# EasyEDA Pro project pcb.epro, schematic Schematic1
Assembly Variant: Basic; Board Name: Board1; Create Date: 2026-03-14; Page Name: P1; Project Name: stm32; Schematic Name: Schematic1; Update Date: 2026-03-14; Company: 嘉立创EDA; Page Size: A4; Version: V1.0
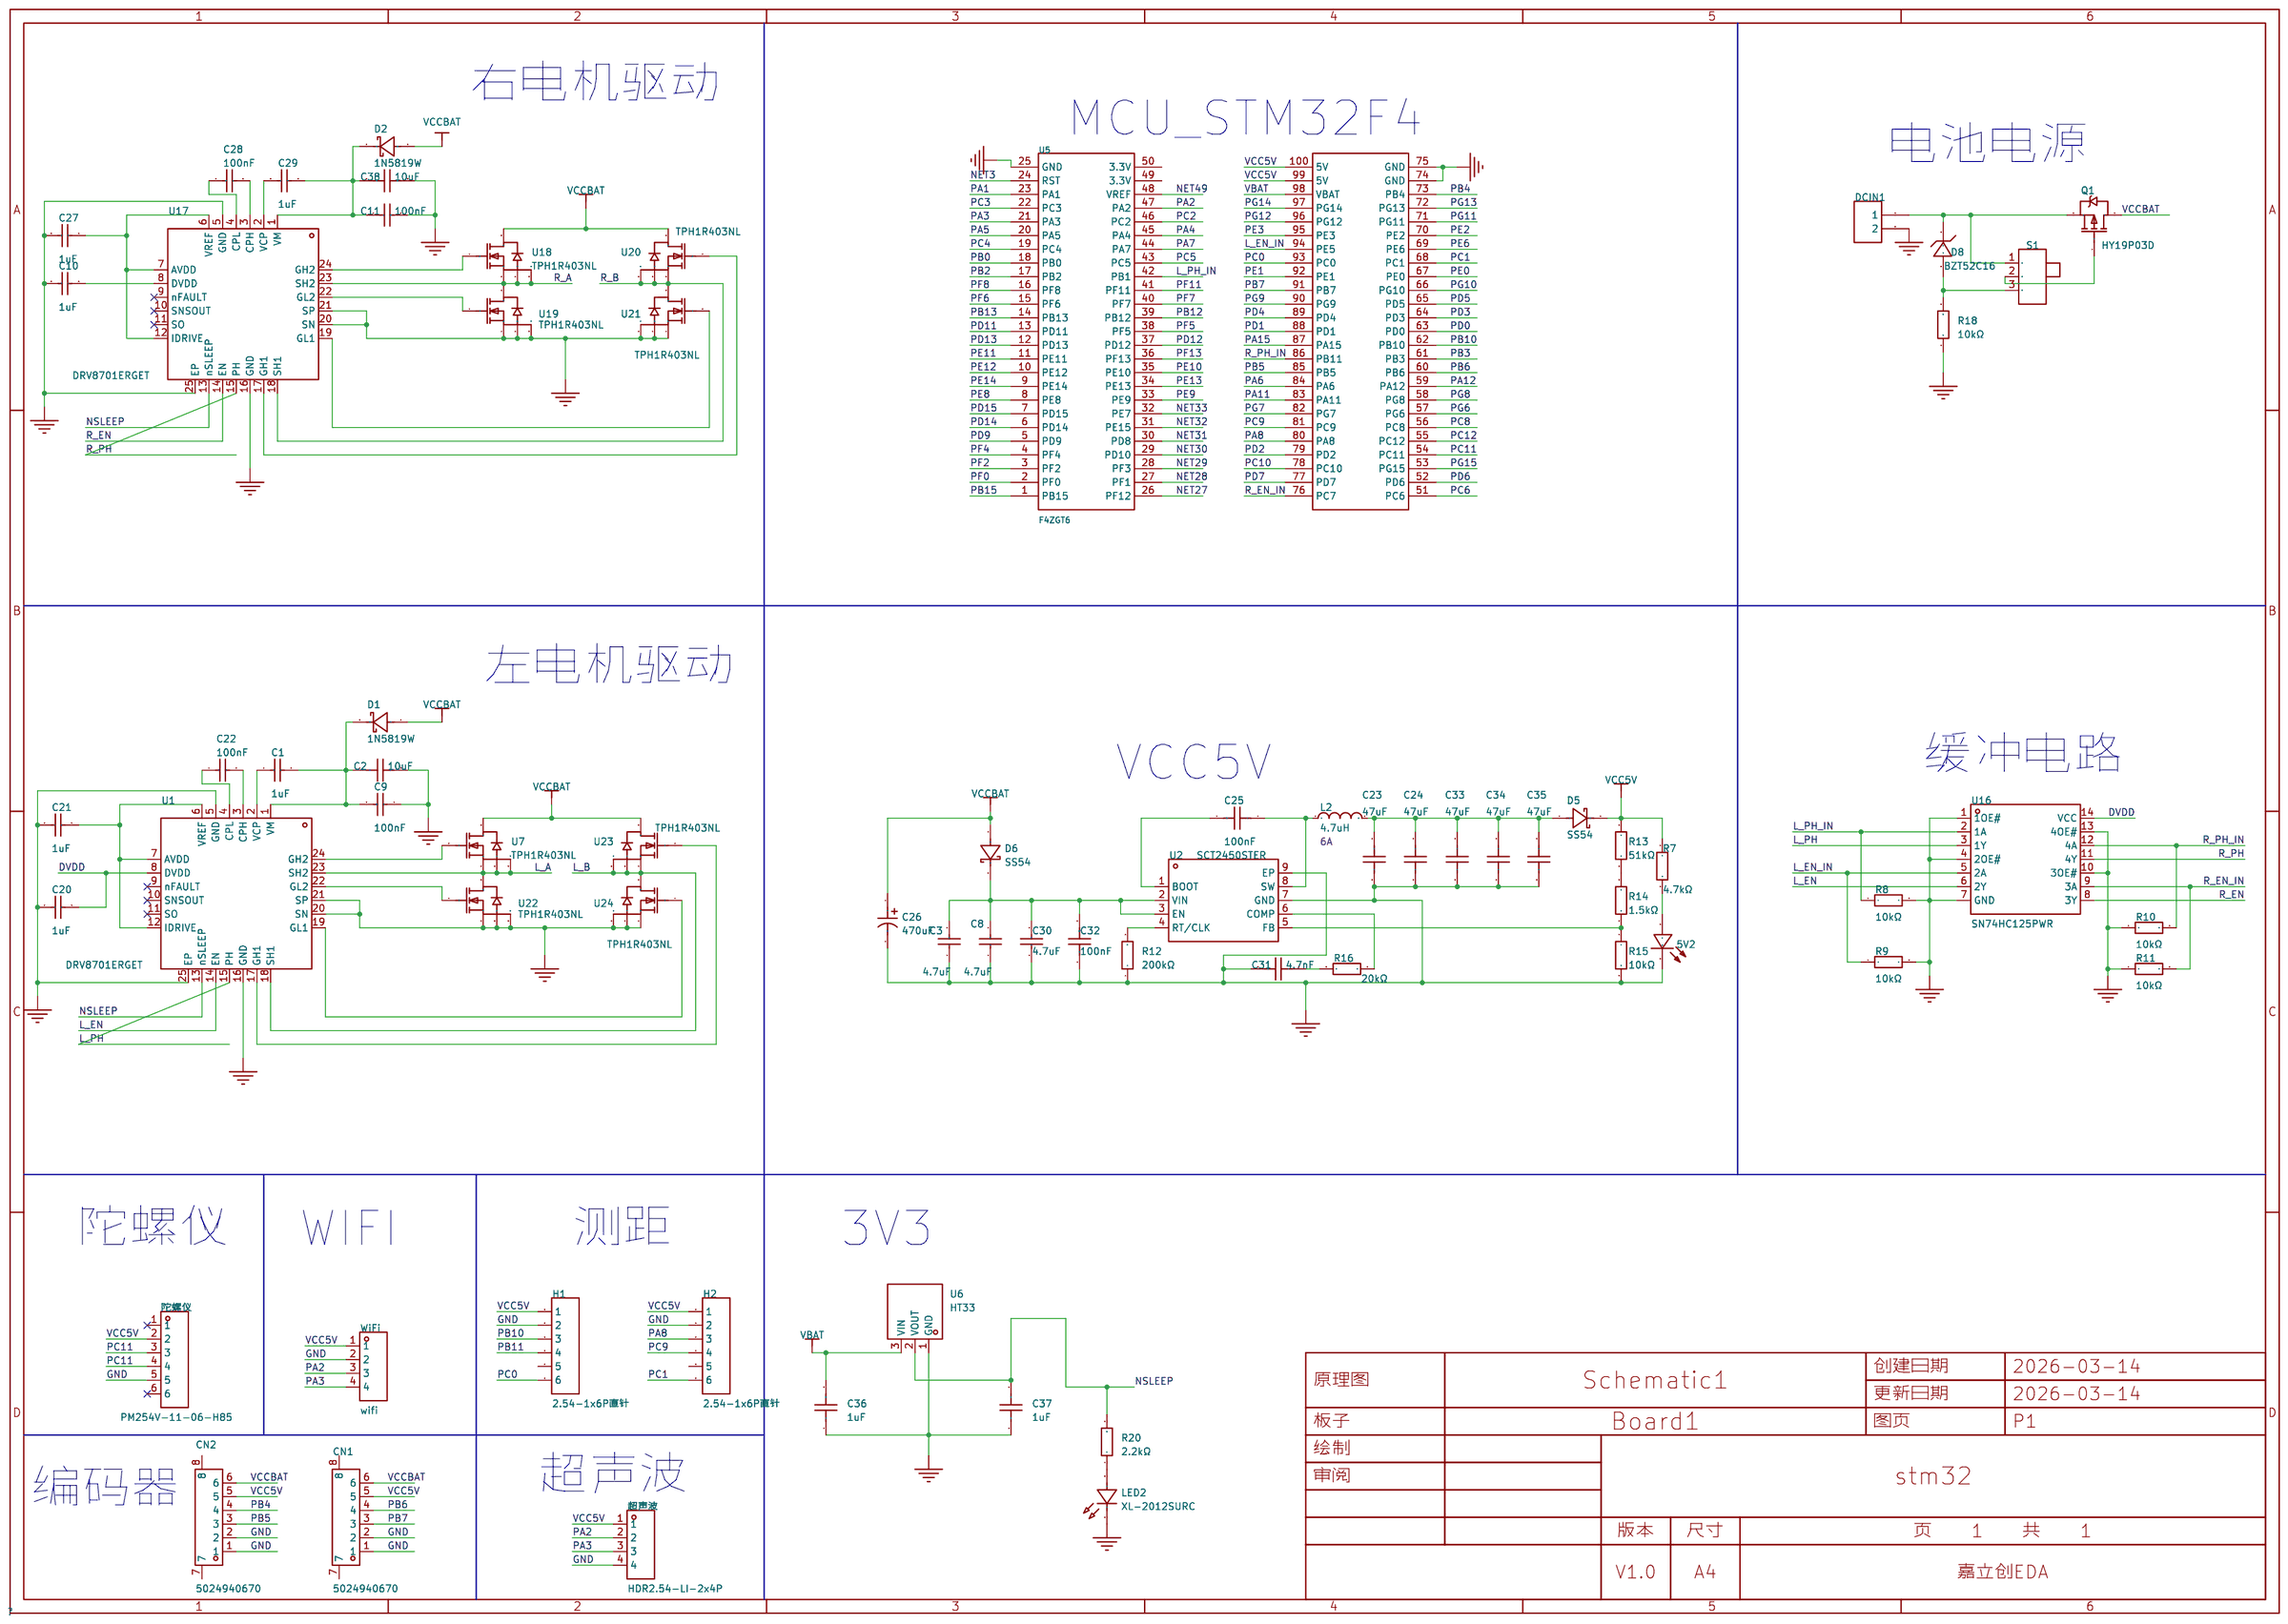
[diagram p0: schematic sheet]

## Parts
5V2  15-21VGC/TR8  [LED0603_GREEN]
C1  1uF  [C0603]
C2  10uF  [C0603]
C3  4.7uF  [C0805]
C8  4.7uF  [C0805]
C9  100nF  [C0603]
C10  1uF  [C0603]
C11  100nF  [C0603]
C20  1uF  [C0603]
C21  1uF  [C0603]
C22  100nF  [C0603]
C23  47uF  [C1210]
C24  47uF  [C1210]
C25  100nF  [C0603]
C26  470uF  [CAP-TH_BD8.0-P3.50-D0.6-FD_1]
C27  1uF  [C0603]
C28  100nF  [C0603]
C29  1uF  [C0603]
C30  4.7uF  [C0603]
C31  4.7nF  [C0603]
C32  100nF  [C0603]
C33  47uF  [C1210]
C34  47uF  [C1210]
C35  47uF  [C1210]
C36  1uF  [C0603]
C37  1uF  [C0603]
C38  10uF  [C0603]
CN1  5024940670  [CONN-SMD_5024940670]
CN2  5024940670  [CONN-SMD_5024940670]
D1  1N5819W  [SOD-123_L2.7-W1.6-LS3.7-R-RD]
D2  1N5819W  [SOD-123_L2.7-W1.6-LS3.7-R-RD]
D5  SS54  [SMA_L4.4-W2.8-LS5.4-R-RD]
D6  SS54  [SMA_L4.4-W2.8-LS5.4-R-RD]
D8  BZT52C16  [SOD-123_L2.7-W1.6-LS3.7-RD]
DCIN1  -  [con_5mm]
H1  2.54-1x6P直针  [HDR-TH_6P-P2.54-V-M-1]
H2  2.54-1x6P直针  [HDR-TH_6P-P2.54-V-M-1]
L2  4.7uH  [IND-SMD_L7.2-W6.6_GPSR07X0]
LED2  XL-2012SURC  [LED0805-RD_RED]
Q1  HY19P03D  [TO-252-2_L6.6-W6.1-P4.57-LS9.9-TL-CW]
R7  4.7kΩ  [R0603]
R8  10kΩ  [R0603]
R9  10kΩ  [R0603]
R10  10kΩ  [R0603]
R11  10kΩ  [R0603]
R12  200kΩ  [R0603]
R13  51kΩ  [R0603]
R14  1.5kΩ  [R0603]
R15  10kΩ  [R0603]
R16  20kΩ  [R0603]
R18  10kΩ  [R0603]
R20  2.2kΩ  [R0603]
S1  K3-1391D-5MM  [SW-TH_K3-1391D-5MM]
U1  DRV8701ERGET  [VQFN-24_L4.0-W4.0-P0.50-BL-EP2.5]
U2  SCT2450STER  [ESOP-8_L4.9-W3.9-P1.27-LS6.0-BL-EP]
U5  F4ZGT6  [STM32F407ZGT6—正点原子最小系统板【旧版】]
U6  HT33  [SOT-23-3_L2.9-W1.3-P1.90-LS2.4-BL-1]
U7  TPH1R403NL  [TDSON-8_L5.9-W5.2-P1.27-BL]
U16  SN74HC125PWR  [TSSOP-14_L5.0-W4.4-P0.65-LS6.5-BL]
U17  DRV8701ERGET  [VQFN-24_L4.0-W4.0-P0.50-BL-EP2.5]
U18  TPH1R403NL  [TDSON-8_L5.9-W5.2-P1.27-BL]
U19  TPH1R403NL  [TDSON-8_L5.9-W5.2-P1.27-BL]
U20  TPH1R403NL  [TDSON-8_L5.9-W5.2-P1.27-BL]
U21  TPH1R403NL  [TDSON-8_L5.9-W5.2-P1.27-BL]
U22  TPH1R403NL  [TDSON-8_L5.9-W5.2-P1.27-BL]
U23  TPH1R403NL  [TDSON-8_L5.9-W5.2-P1.27-BL]
U24  TPH1R403NL  [TDSON-8_L5.9-W5.2-P1.27-BL]
WiFi  wifi  [HDR-TH_4P-P2.54-V-F]
超声波  HDR2.54-LI-2x4P  [HDR-TH_4P-P2.54-V-M]
陀螺仪  PM254V-11-06-H85  [HDR-TH_6P-P2.54-V-F]

## Library data of the parts
5V2 = 15-21VGC/TR8: 照明颜色:普绿/黄绿;色温 - CCT（K）:-;主波长/色坐标:571nm;; LCSC Part Name: 发光二极管1206普绿/黄绿; Supplier Part: C131289; Manufacturer: EVERLIGHT(亿光); Supplier Footprint: 1206; JLCPCB Part Class: Extended Part; Datasheet: https://atta.szlcsc.com/upload/public/pdf/source/20170918/C131289_1505726897595976297.pdf; Supplier: LCSC; Mounting Type: 表面贴装; Illumination Color: 普绿/黄绿; Luminous Intensity (IF=20mA): 13mcd; Dominant Wavelength / Coordinate rank: 571nm
C1 C10 C20 C21 C27 C29 = CL10A105KB8NNNC: 容值:1uF;精度:±10%;额定电压:50V;材质(温度系数):X5R;; LCSC Part Name: 1uF ±10% 50V; Supplier Part: C15849; Manufacturer: SAMSUNG(三星); Supplier Footprint: 0603; JLCPCB Part Class: 基础库; Datasheet: https://atta.szlcsc.com/upload/public/pdf/source/20160218/1457707763339.pdf; Supplier: LCSC; Tolerance: ±10%; Voltage Rated: 50V; Temperature Coefficient: X5R
C2 C38 = CL10A106MA8NRNC: 容值:10uF;精度:±20%;额定电压:25V;材质(温度系数):X5R;; LCSC Part Name: 10uF ±20% 25V; Supplier Part: C96446; Manufacturer: SAMSUNG(三星); Supplier Footprint: 0603; JLCPCB Part Class: 基础库; Datasheet: https://atta.szlcsc.com/upload/public/pdf/source/20160218/1457707763339.pdf; Supplier: LCSC; Tolerance: ±20%; Voltage Rated: 25V; Temperature Coefficient: X5R
C3 C8 = CL21A475KAQNNNE: 容值:4.7uF;精度:±10%;额定电压:25V;温度系数:X5R;; LCSC Part Name: 4.7uF ±10% 25V; Supplier Part: C1779; Manufacturer: SAMSUNG(三星); Supplier Footprint: 0805; JLCPCB Part Class: 基础库; Datasheet: https://item.szlcsc.com/datasheet/CL21A475KAQNNNE/2131.html; Supplier: LCSC; Tolerance: ±10%; Voltage Rating: 25V; Temperature Coefficient: X5R
C9 C11 C22 C28 = 0603B104K500NT: 容值:100nF;精度:±10%;额定电压:50V;材质(温度系数):X7R;; LCSC Part Name: 100nF ±10% 50V; Supplier Part: C30926; Manufacturer: FH(风华); Supplier Footprint: 0603; JLCPCB Part Class: 扩展库; Datasheet: https://atta.szlcsc.com/upload/public/pdf/source/20200305/C486355_26A10D38EF8C2A5C37091D0039909270.pdf; Supplier: LCSC; Tolerance: ±10%; Voltage Rated: 50V; Temperature Coefficient: X7R
C23 C24 C33-C35 = GRM32ER61C476KE15L: 容值:47uF;精度:±10%;额定电压:16V;温度系数:X5R;; LCSC Part Name: 47uF ±10% 16V; Supplier Part: C77101; Manufacturer: muRata(村田); Supplier Footprint: 1210; JLCPCB Part Class: 扩展库; Datasheet: https://item.szlcsc.com/datasheet/GRM32ER61C476KE15L/78228.html; Supplier: LCSC; Tolerance: ±10%; Voltage Rating: 16V; Temperature Coefficient: X5R
C25 C32 = CL10B104KB8NNNC: 容值:100nF;精度:±10%;额定电压:50V;材质(温度系数):X7R;; LCSC Part Name: 100nF ±10% 50V; Supplier Part: C1591; Manufacturer: SAMSUNG(三星); Supplier Footprint: 0603; JLCPCB Part Class: Extended Part; Datasheet: https://atta.szlcsc.com/upload/public/pdf/source/20160103/1457707680512.pdf; Supplier: LCSC; Tolerance: ±10%; Voltage Rated: 50V; Temperature Coefficient: X7R
C26 = CD2884771EM0812VFL: 容值:470uF;精度:±20%;额定电压:25V;纹波电流:905mA@100kHz;等效串联电阻(ESR):69mΩ@100kHz;; LCSC Part Name: 470uF ±20% 25V; Supplier Part: C2960233; Manufacturer: HRK(鸿瑞凯电子); Supplier Footprint: 插件,D8xL12mm; JLCPCB Part Class: Extended Part; Datasheet: https://item.szlcsc.com/datasheet/CD2884771EM0812VFL/3346945.html; Supplier: LCSC; Tolerance: ±20%; Voltage Rating: 25V; Ripple Current: 905mA@100kHz; Equivalent Series Resistance(ESR): 69mΩ@100kHz; Pin Spacing: 3.5mm; Diameter: 8mm; Height - Seated (Max): 12mm; Lifetime: 3000hrs@105℃; Operating Temperature: -40℃~+105℃
C30 = CL31B475KBHNNNE: 容值:4.7uF;精度:±10%;额定电压:50V;材质(温度系数):X7R;; LCSC Part Name: 4.7uF ±10% 50V; Supplier Part: C51205; Manufacturer: SAMSUNG(三星); Supplier Footprint: 1206; JLCPCB Part Class: Extended Part; Datasheet: https://atta.szlcsc.com/upload/public/pdf/source/20160103/1457707732693.pdf; Supplier: LCSC; Tolerance: ±10%; Voltage Rated: 50V; Temperature Coefficient: X7R
C31 = MT18B472K500CT: 容值:4.7nF;精度:±10%;额定电压:50V;材质(温度系数):X7R;; LCSC Part Name: 4.7nF ±10% 50V; Supplier Part: C366882; Manufacturer: Walsin(华新科); Supplier Footprint: 0603; JLCPCB Part Class: 扩展库; Datasheet: https://atta.szlcsc.com/upload/public/pdf/source/20190225/C366882_E806E7D8175088070BA62B5811C10C1A.pdf; Supplier: LCSC; Tolerance: ±10%; Voltage Rated: 50V; Temperature Coefficient: X7R
C36 C37 = CGA0603X5R105K500JT: 容值:1uF;精度:±10%;额定电压:50V;温度系数:X5R;; LCSC Part Name: 1uF ±10% 50V; Supplier Part: C6119852; Manufacturer: HRE(芯声); Supplier Footprint: 0603; JLCPCB Part Class: 扩展库; Supplier: LCSC; Tolerance: ±10%; Voltage Rating: 50V; Temperature Coefficient: X5R
CN1 CN2 = 5024940670: 插针结构:1x6P;间距:2mm;安装方式:卧贴;总PIN数:6P;排数:1;每排PIN数:6;额定电流:3A;触头镀层:锡;工作温度:-40℃~+105℃;; LCSC Part Name: 1x6P 间距:2mm 卧贴; Supplier Part: C587930; Manufacturer: MOLEX; Supplier Footprint: SMD,P=2mm,卧贴; JLCPCB Part Class: Extended Part; Datasheet: https://www.molex.com/content/dam/molex/molex-dot-com/products/automated/en-us/salesdrawingpdf/502/502494/5024940670_sd.pdf?inline\; Supplier: LCSC; Pins Structure: 1x6P; Pitch: 2mm; Mounting Type: 卧贴; Number of Pins: 6P; Number of Rows: 1; Number of PINs Per Row: 6; Current Rating: 3A; Contact Plating: 锡; Operating Temperature: -40℃~+105℃; Voltage Rating: 250V
D1 D2 = 1N5819W_C963381: 二极管配置:独立式;正向压降(Vf):600mV@200mA;直流反向耐压(Vr):40V;平均整流电流(Io):350mA;; LCSC Part Name: 电压:40V 电流:350mA; Supplier Part: C963381; Manufacturer: JSMSEMI(杰盛微); Supplier Footprint: SOD-123; JLCPCB Part Class: 扩展库; Datasheet: https://atta.szlcsc.com/upload/public/pdf/source/20230807/ADD53622154D5B572F84A7B877E922CE.pdf; Supplier: LCSC; Diode Configuration: 独立式; Forward Voltage (Vf@If): 600mV@200mA; Reverse Voltage (Vr): 40V; Average Rectified Current (Io): 350mA; Reverse Leakage Current (Ir): 5uA@30V
D5 D6 = SS54_C513478: 直流反向耐压(Vr):40V;平均整流电流(Io):5A;正向压降(Vf):550mV@5A;; LCSC Part Name: 40V 5A 550mV@5A; Supplier Part: C513478; Manufacturer: Slkor(萨科微); Supplier Footprint: SMA; JLCPCB Part Class: Extended Part; Datasheet: https://atta.szlcsc.com/upload/public/pdf/source/20200414/C513471_6461A1BCB05B602A4F47401B394AA5A8.pdf; Supplier: LCSC; Reverse Voltage (Vr): 40V; Average Rectified Current (Io): 5A; Forward Voltage (Vf@If): 550mV@5A
D8 = BZT52C16_C173426: 二极管配置:独立式;稳压值(标称值):16V;稳压值(范围):15.3V~17.1V;精度:-;功率:500mW;反向电流(Ir):100nA@11.2V;阻抗(Zzt):40Ω;; LCSC Part Name: 16V 500mW; Supplier Part: C173426; Manufacturer: MDD; Supplier Footprint: SOD-123; JLCPCB Part Class: Extended Part; Datasheet: https://atta.szlcsc.com/upload/public/pdf/source/20180207/C173426_15179895458921356272.pdf; Supplier: LCSC; Diode Configuration: 独立式; Zener Voltage (Nom): 16V; Zener Voltage (Range): 15.3V~17.1V; Power Dissipation: 500mW; Reverse Leakage Current (Ir): 100nA@11.2V; Zener Impedance (Zzt): 40Ω
DCIN1 = DCIN
H1 H2 = 2.54-1x6P直针: 插针结构:1x6P;间距:2.54mm;行距:-;圆针/方针:方针;安装方式:直插;排数:单排;总PIN位数:6P;额定电流:3A;额定电压:-;配合针长度:6mm;塑高:2.5mm;端接针长度:3mm;触头材质:黄铜;触头镀层:金;工作温度:-40℃~+105℃;颜色:黑色;; LCSC Part Name: 1x6P 间距:2.54mm 方针 直插; Supplier Part: C37208; Manufacturer: BOOMELE(博穆精密); Supplier Footprint: 插件,P=2.54mm; JLCPCB Part Class: Extended Part; Datasheet: https://item.szlcsc.com/datasheet/2.54-1x6P%25E7%259B%25B4%25E9%2592%2588/38187.html; Supplier: LCSC; Pin Structure: 1x6P; Pitch: 2.54mm; Circluar Pins/Square Pins: 方针; Mounting Type: 直插; Number of Rows: 单排; Number of Pins: 6P; Current Rating: 3A; Length of Mating Pin: 6mm; Insulation Height: 2.5mm; Length of End Connection Pin: 3mm; Contact Material: 黄铜; Contact Plating: 金; Operating Temperature: -40℃~+105℃; Color: 黑色
L2 = CYA0650-4.7UH: 电感值:4.7uH;精度:±20%;额定电流:6A;直流电阻(DCR):26mΩ;; LCSC Part Name: 4.7uH ±20%; Supplier Part: C5189754; Manufacturer: SHOU HAN(首韩); Supplier Footprint: SMD,7.2x6.6mm; JLCPCB Part Class: Extended Part; Datasheet: https://atta.szlcsc.com/upload/public/pdf/source/20221010/D01C39F02A771397E3958491D6AA7650.pdf; Supplier: LCSC; Tolerance: ±20%; Rated Current: 6A; DC Resistance (DCR): 26mΩ
LED2 = XL-2012SURC: 发光颜色:红色;功率:55mW;正向电流:25mA;主波长:617nm~621nm;透镜颜色:无色透明透镜;色温:-;发光角度:120°;载带方式:正贴;工作温度:-30℃~+85℃;; Supplier Part: C965812; Manufacturer: XINGLIGHT(成兴光); Supplier Footprint: 0805; JLCPCB Part Class: 扩展库; Datasheet: https://atta.szlcsc.com/upload/public/pdf/source/20221102/49E1A0A365644091E6270AF1C5E0FE37.pdf; Supplier: LCSC; Emitted Color: 红色; Power Dissipation: 55mW; Forward Current: 25mA; Dominant Wavelength: 617nm~621nm; Peak Wavelength: 623nm; Lens Color: 无色透明透镜; Viewing Angle: 120°; Mounting Sytle: 正贴; Operating Temperature: -30℃~+85℃
Q1 = HY19P03D: 导通电阻(RDS(on)@Vgs,Id):6mΩ 45A,10V;阈值电压(Vgs(th)@Id):3V 250μA;漏源电压(Vdss):30V;功率(Pd):50W;类型:P沟道;连续漏极电流(Id):90A;; Supplier Part: C122492; Manufacturer: HUAYI(华羿微); Supplier Footprint: TO-252-2L; JLCPCB Part Class: Extended Part; Datasheet: https://atta.szlcsc.com/upload/public/pdf/source/20170728/C122492_1501225751911848809.pdf; Supplier: LCSC; Drain Source On Resistance (RDS(on)@Vgs,Id): 6mΩ 45A,10V; Gate Threshold Voltage (Vgs(th)@Id): 3V 250μA; Drain Source Voltage (Vdss): 30V; Power Dissipation (Pd): 50W; Type: P沟道; Continuous Drain Current (Id): 90A
R7 R12-R16 R18 = RC0603FR-074K7L: 阻值:4.7kΩ;精度:±1%;功率:100mW;温度系数:±100ppm/℃;最大工作电压:75V;工作温度范围:-55℃~+155℃;; LCSC Part Name: 4.7kΩ ±1% 100mW; Supplier Part: C99782; Manufacturer: YAGEO(国巨); Supplier Footprint: 0603; JLCPCB Part Class: Extended Part; Datasheet: https://atta.szlcsc.com/upload/public/pdf/source/20171030/C99782_15093665213961068236.pdf; Supplier: LCSC; Tolerance: ±1%; Power(Watts): 100mW; Temperature Coefficient: ±100ppm/℃; Overload Voltage (Max): 75V; Operating Temperature Range: -55℃~+155℃
R8-R11 = 0603WAF1002T5E: 电阻类型:厚膜电阻;阻值:10kΩ;精度:±1%;功率:100mW;最大工作电压:75V;温度系数:±100ppm/℃;; LCSC Part Name: 厚膜电阻 10kΩ ±1% 100mW; Supplier Part: C25804; Manufacturer: UNI-ROYAL(厚声); Supplier Footprint: 0603; JLCPCB Part Class: 基础库; Datasheet: https://atta.szlcsc.com/upload/public/pdf/source/20200306/C422600_1E6D84923E4A46A82E41ADD87F860B5C.pdf; Supplier: LCSC; Type: 厚膜电阻; Tolerance: ±1%; Power(Watts): 100mW; Overload Voltage (Max): 75V; Temperature Coefficient: ±100ppm/℃; Operating Temperature Range: -55℃~+155℃
R20 = 0603WAF2201T5E: 电阻类型:厚膜电阻;阻值:2.2kΩ;精度:±1%;功率:100mW;最大工作电压:75V;温度系数:±100ppm/℃;; LCSC Part Name: 2.2kΩ ±1% 100mW 厚膜电阻; Supplier Part: C4190; Manufacturer: UNI-ROYAL(厚声); Supplier Footprint: 0603; JLCPCB Part Class: 基础库; Datasheet: https://atta.szlcsc.com/upload/public/pdf/source/20200306/C422600_1E6D84923E4A46A82E41ADD87F860B5C.pdf; Supplier: LCSC; Type: 厚膜电阻; Tolerance: ±1%; Power(Watts): 100mW; Overload Voltage (Max): 75V; Temperature Coefficient: ±100ppm/℃; Operating Temperature Range: -55℃~+155℃
S1 = K3-1391D-5MM: 额定电流(AC):5A;额定电压(AC):120V;电路结构:单刀双掷;安装方式:直插;机械寿命:30000;开关颜色:黑色;滑钮形状:矩形柱状;引脚样式:PC引脚;工作温度:-25℃~+80℃;开关长度:13.3mm;开关宽度:6mm;开关高度:6.6mm;; LCSC Part Name: 大电流直插式滑动开关; Supplier Part: C970579; Manufacturer: 韩国韩荣; Supplier Footprint: 插件; JLCPCB Part Class: Extended Part; Datasheet: https://atta.szlcsc.com/upload/public/pdf/source/20201211/C970579_603CDB6D9DEEEE4ED10454FCD9A65E24.pdf; Supplier: LCSC; Current Rating (AC): 5A; Voltage Rating (AC): 120V; Circuit: 单刀双掷; Mounting Sytle: 直插; Mechanical Life: 30000; Actuator Color: 黑色; Actuator Style: 矩形柱状; Pin Style: PC引脚; Operating Temperature: -25℃~+80℃; Switch Length: 13.3mm; Switch Width: 6mm; Switch Height: 6.6mm
U1 U17 = DRV8701ERGET: 驱动电机类型:有刷直流电机;电源电压:0V~5.5V;输出电流:-;接口:并行;; LCSC Part Name: 有刷直流电机驱动芯片 5.5V; Supplier Part: C132049; Manufacturer: TI(德州仪器); Supplier Footprint: VQFN-24(4x4); JLCPCB Part Class: 扩展库; Datasheet: https://www.ti.com/cn/lit/gpn/drv8701; Supplier: LCSC; Drive motor type: 有刷直流电机; Supply Voltage: 0V~5.5V; Interface: 并行; Operating Temperature: -40℃~+125℃@(Ta)
U2 = SCT2450STER: LCSC Part Name: 电源IC; Supplier Part: C509400; Manufacturer: SCT(芯洲科技); Supplier Footprint: ESOP-8; JLCPCB Part Class: 扩展库; Datasheet: https://atta.szlcsc.com/upload/public/pdf/source/20200407/C509400_EDF779A672A59398CFBA9E95FA584FEC.pdf; Supplier: LCSC
U5 = F4ZGT6
U6 = HT33: 输出类型:固定;最大输入电压:24V;输出电压:3.3V;输出电流:100mA;输出极性:正极;; LCSC Part Name: 低压差线性稳压器LDO; Supplier Part: C19712023; Manufacturer: XCH(旭昌辉); Supplier Footprint: SOT-23; JLCPCB Part Class: 扩展库; Datasheet: https://atta.szlcsc.com/upload/public/pdf/source/20231215/2A873B6E74218B45E4E50525D0FF0C7C.pdf; Supplier: LCSC; Output Type: 固定; Maximum Input Voltage: 24V; Output Voltage: 3.3V; Output Current: 100mA; Output Polarity: 正极
U7 U18-U24 = TPH1R403NL_C19268167: Supplier Part: C19268167; Manufacturer: TECH PUBLIC(台舟); Datasheet: https://atta.szlcsc.com/upload/public/pdf/source/20231201/E668D9B30DA1C5FDF2CA4EE637776407.pdf; Supplier: LCSC
U16 = SN74HC125PWR: 输入类型:-;电源电压:2V~6V;元件数:4;每个元件位数:1;灌电流(IOL):7.8mA;拉电流(IOH):7.8mA;; Supplier Part: C132994; Manufacturer: TI(德州仪器); Supplier Footprint: TSSOP-14; JLCPCB Part Class: 扩展库; Datasheet: https://www.ti.com/cn/lit/gpn/sn74hc125; Supplier: LCSC; output type: 三态; Supply Voltage: 2V~6V; Number of Elements: 4; Number of Bits per Element: 1; Sink Current: 7.8mA; Source Current: 7.8mA; Logic Family: 74HC; Operating Temperature: -40℃~+85℃
WiFi = 2.54-1*4P母: 插孔结构:1x4P;间距:2.54mm;行距:-;圆孔/方孔:方孔;安装方式:直插;排数:单排;总孔位数:4P;额定电流:3A;额定电压:-;插孔方向:顶部;塑高:-;触头材质:青铜;触头镀层:-;工作温度:-40℃~+105℃;; LCSC Part Name: 间距:2.54mm 1x4P 直插; Supplier Part: C2718488; Manufacturer: BOOMELE(博穆精密); Supplier Footprint: 插件,P=2.54mm; JLCPCB Part Class: Extended Part; Datasheet: https://item.szlcsc.com/datasheet/2.54-1*4P%25E6%25AF%258D/2834502.html; Supplier: LCSC; Holes Structure: 1x4P; Pitch: 2.54mm; Circular Hole / Square Hole: 方孔; Mounting Type: 直插; Number of Rows: 单排; Number of Positions: 4P; Current Rating: 3A; Holes Direction: 顶部; Contact Material: 青铜; Operating Temperature: -40℃~+105℃
超声波 = HDR2.54-LI-2x4P: Supplier Part: C9900020145; JLCPCB Part Class: Extended Part; Supplier: LCSC
陀螺仪 = PM254V-11-06-H85: 插孔结构:1x6P;间距:2.54mm;行距:-;圆孔/方孔:方孔;安装方式:直插;排数:单排;总孔位数:6P;额定电流:3A;额定电压:250V;插孔方向:顶部;塑高:-;工作温度:-40℃~+105℃;; LCSC Part Name: 间距:2.54mm 1x6P 直插; Supplier Part: C2832269; Manufacturer: XFCN(兴飞); Supplier Footprint: 插件,P=2.54mm; JLCPCB Part Class: Extended Part; Datasheet: https://item.szlcsc.com/datasheet/PM254V-11-06-H85/2989787.html; Supplier: LCSC; Holes Structure: 1x6P; Pitch: 2.54mm; Circular Hole / Square Hole: 方孔; Mounting Type: 直插; Number of Rows: 单排; Number of Positions: 6P; Current Rating: 3A; Voltage Rating (Max): 250V; Holes Direction: 顶部; Operating Temperature: -40℃~+105℃

## Nets
DVDD: C20.2 U1.8(DVDD) U16.14(VCC)
GND: 5V2.2(C) C2.2 C3.1 C8.1 C9.1 C10.1 C11.2 C20.1 C21.1 C23.2 C24.1 C26.2 C27.1 C30.1 C31.2 C32.1 C33.2 C34.1 C35.2 C36.1 C37.1 C38.2 CN1.1 CN1.2 CN2.1 CN2.2 DCIN1.2 H1.2 H2.2 LED2.1(K) R8.2 R9.2 R10.1 R11.1 R12.1 R15.2 R18.1 U1.5(GND) U1.16(GND) U1.20(SN) U1.21(SP) U1.25(EP) U2.7(GND) U2.9(EP) U5.25(GND) U5.74(GND) U5.75(GND) U6.1(GND) U16.1(1OE#) U16.4(2OE#) U16.7(GND) U16.10(3OE#) U16.13(4OE#) U17.5(GND) U17.16(GND) U17.20(SN) U17.21(SP) U17.25(EP) U19.1(S) U19.2(S) U19.3(S) U21.1(S) U21.2(S) U21.3(S) U22.1(S) U22.2(S) U22.3(S) U24.1(S) U24.2(S) U24.3(S) WiFi.2 超声波.4 陀螺仪.5
VBAT: C36.2 U5.98(VBAT) U6.3(VIN)
VCC5V: CN1.5 CN2.5 D5.2(K) H1.1 H2.1 R7.1 R13.1 U5.99(5V) U5.100(5V) WiFi.1 超声波.1 陀螺仪.2
VCCBAT: C26.1 CN1.6 CN2.6 D1.1(A) D2.1(A) D6.1(A) Q1.2(D) U7.5(D) U18.5(D) U20.5(D) U23.5(D)
L_A: U1.23(SH2) U7.1(S) U7.2(S) U7.3(S) U22.5(D)
L_B: U1.18(SH1) U23.1(S) U23.2(S) U23.3(S) U24.5(D)
L_EN: U1.14(EN) U16.6(2Y)
L_EN_IN: R9.1 U5.94(PE5) U16.5(2A)
L_PH: U1.15(PH) U16.3(1Y)
L_PH_IN: R8.1 U5.42(PB1) U16.2(1A)
NET3: U5.24(RST)
NET27: U5.26(PF12)
NET28: U5.27(PF1)
NET29: U5.28(PF3)
NET30: U5.29(PD10)
NET31: U5.30(PD8)
NET32: U5.31(PE15)
NET33: U5.32(PE7)
NET49: U5.48(VREF)
NSLEEP: C37.2 R20.2 U1.13(nSLEEP) U6.2(VOUT) U17.13(nSLEEP)
PA1: U5.23(PA1)
PA2: U5.47(PA2) WiFi.3 超声波.2
PA3: U5.21(PA3) WiFi.4 超声波.3
PA4: U5.45(PA4)
PA5: U5.20(PA5)
PA6: U5.84(PA6)
PA7: U5.44(PA7)
PA8: H2.3 U5.80(PA8)
PA11: U5.83(PA11)
PA12: U5.59(PA12)
PA15: U5.87(PA15)
PB0: U5.18(PB0)
PB2: U5.17(PB2)
PB3: U5.61(PB3)
PB4: CN2.4 U5.73(PB4)
PB5: CN2.3 U5.85(PB5)
PB6: CN1.4 U5.60(PB6)
PB7: CN1.3 U5.91(PB7)
PB10: H1.3 U5.62(PB10)
PB11: H1.4
PB12: U5.39(PB12)
PB13: U5.14(PB13)
PB15: U5.1(PB15)
PC0: H1.6 U5.93(PC0)
PC1: H2.6 U5.68(PC1)
PC2: U5.46(PC2)
PC3: U5.22(PC3)
PC4: U5.19(PC4)
PC5: U5.43(PC5)
PC6: U5.51(PC6)
PC8: U5.56(PC8)
PC9: H2.4 U5.81(PC9)
PC10: U5.78(PC10)
PC11: U5.54(PC11) 陀螺仪.3 陀螺仪.4
PC12: U5.55(PC12)
PD0: U5.63(PD0)
PD1: U5.88(PD1)
PD2: U5.79(PD2)
PD3: U5.64(PD3)
PD4: U5.89(PD4)
PD5: U5.65(PD5)
PD6: U5.52(PD6)
PD7: U5.77(PD7)
PD9: U5.5(PD9)
PD11: U5.13(PD11)
PD12: U5.37(PD12)
PD13: U5.12(PD13)
PD14: U5.6(PD14)
PD15: U5.7(PD15)
PE0: U5.67(PE0)
PE1: U5.92(PE1)
PE2: U5.70(PE2)
PE3: U5.95(PE3)
PE6: U5.69(PE6)
PE8: U5.8(PE8)
PE9: U5.33(PE9)
PE10: U5.35(PE10)
PE11: U5.11(PE11)
PE12: U5.10(PE12)
PE13: U5.34(PE13)
PE14: U5.9(PE14)
PF0: U5.2(PF0)
PF2: U5.3(PF2)
PF4: U5.4(PF4)
PF5: U5.38(PF5)
PF6: U5.15(PF6)
PF7: U5.40(PF7)
PF8: U5.16(PF8)
PF11: U5.41(PF11)
PF13: U5.36(PF13)
PG6: U5.57(PG6)
PG7: U5.82(PG7)
PG8: U5.58(PG8)
PG9: U5.90(PG9)
PG10: U5.66(PG10)
PG11: U5.71(PG11)
PG12: U5.96(PG12)
PG13: U5.72(PG13)
PG14: U5.97(PG14)
PG15: U5.53(PG15)
R_A: U17.23(SH2) U18.1(S) U18.2(S) U18.3(S) U19.5(D)
R_B: U17.18(SH1) U20.1(S) U20.2(S) U20.3(S) U21.5(D)
R_EN: U16.8(3Y) U17.14(EN)
R_EN_IN: R11.2 U5.76(PC7) U16.9(3A)
R_PH: U16.11(4Y) U17.15(PH)
R_PH_IN: R10.2 U5.86(PB11) U16.12(4A)
$2N35: Q1.1(G) S1.2
$2N36: D8.2(A) R18.2 S1.3
$2N66: R13.2 R14.1
$2N67: R14.2 R15.1 U2.5(FB)
$2N69: R16.1 U2.6(COMP)
$2N70: C25.1 L2.1 U2.8(SW)
$2N71: R12.2 U2.4(RT/CLK)
$2N72: C25.2 U2.1(BOOT)
$2N73: C31.1 R16.2
$2N77: C23.1 C24.2 C33.1 C34.2 C35.1 D5.1(A) L2.2
$2N78: C3.2 C8.2 C30.2 C32.2 D6.2(K) U2.2(VIN) U2.3(EN)
Net-(5V2-1): 5V2.1(A) R7.2
Net-(C1-1): C1.1 U1.2(VCP)
Net-(C1-2): C1.2 C2.1 C9.2 D1.2(C) U1.1(VM)
Net-(C10-2): C10.2 U17.8(DVDD)
Net-(C11-1): C11.1 C29.2 C38.1 D2.2(C) U17.1(VM)
Net-(C21-2): C21.2 U1.6(VREF) U1.7(AVDD) U1.12(IDRIVE)
Net-(C22-1): C22.1 U1.4(CPL)
Net-(C22-2): C22.2 U1.3(CPH)
Net-(C27-2): C27.2 U17.6(VREF) U17.7(AVDD) U17.12(IDRIVE)
Net-(C28-1): C28.1 U17.4(CPL)
Net-(C28-2): C28.2 U17.3(CPH)
Net-(C29-1): C29.1 U17.2(VCP)
Net-(D8-1): D8.1(K) DCIN1.1 Q1.3(S) S1.1
Net-(LED2-2): LED2.2(A) R20.1
Net-(U1-17): U1.17(GH1) U23.4(G)
Net-(U1-19): U1.19(GL1) U24.4(G)
Net-(U1-22): U1.22(GL2) U22.4(G)
Net-(U1-24): U1.24(GH2) U7.4(G)
Net-(U17-17): U17.17(GH1) U20.4(G)
Net-(U17-19): U17.19(GL1) U21.4(G)
Net-(U17-22): U17.22(GL2) U19.4(G)
Net-(U17-24): U17.24(GH2) U18.4(G)

Not connected (* = marked no-connect by the designer): CN1 7 8; CN2 7 8; H1 5; H2 5; U1 9(nFAULT)* 10(SNSOUT)* 11(SO)*; U5 49(3.3V) 50(3.3V); U17 9(nFAULT)* 10(SNSOUT)* 11(SO)*; 陀螺仪 1* 6*

## Notes on the sheet
- 右电机驱动
- MCU_STM32F4
- 电池电源
- 左电机驱动
- 缓冲电路
- VCC5V
- 陀螺仪
- WIFI
- 测距
- 3V3
- 超声波
- 编码器
